# EAGLE design t84 (EAGLE 7.7.0)
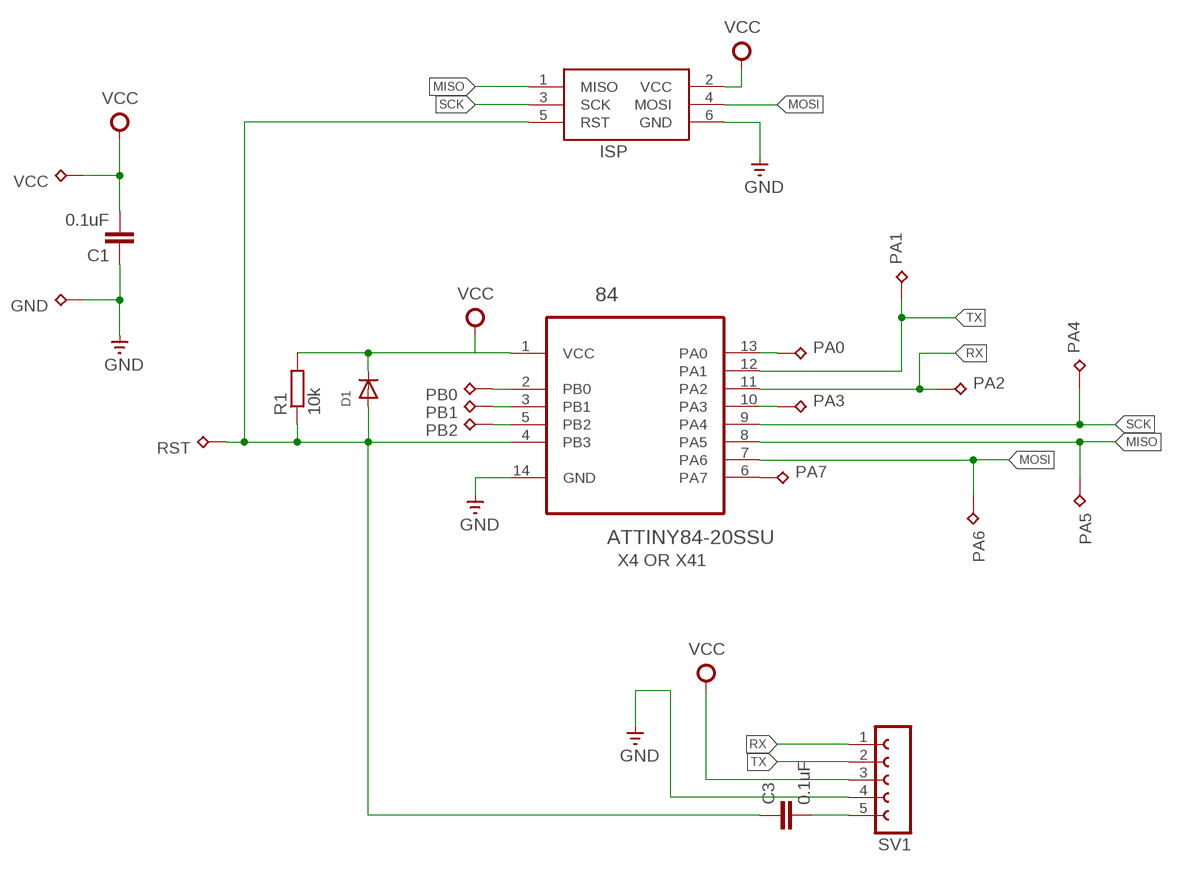
[diagram p0: schematic, sheet 1]

## Parts
84  ATTINY84-20SSU  [SOIC127P600X175-14N]
C1  0.1uF  C-EUC0805K  [C0805K]
C3  0.1uF  C-EUC0805K  [C0805K]
D1  DIODESOD-123  [SOD-123]
GND  1XPIN-HEADER  [1XPIN-HEADER]
ISP  AVRISP-6  [AVRISP]
PA0  1XPIN-HEADER  [1XPIN-HEADER]
PA1  1XPIN-HEADER  [1XPIN-HEADER]
PA2  1XPIN-HEADER  [1XPIN-HEADER]
PA3  1XPIN-HEADER  [1XPIN-HEADER]
PA4  1XPIN-HEADER  [1XPIN-HEADER]
PA5  1XPIN-HEADER  [1XPIN-HEADER]
PA6  1XPIN-HEADER  [1XPIN-HEADER]
PA7  1XPIN-HEADER  [1XPIN-HEADER]
PB0  1XPIN-HEADER  [1XPIN-HEADER]
PB1  1XPIN-HEADER  [1XPIN-HEADER]
PB2  1XPIN-HEADER  [1XPIN-HEADER]
R1  10k  R-EU_M0805  [M0805]
RST  1XPIN-HEADER  [1XPIN-HEADER]
SV1  FE05-1  [FE05-1]
VCC  1XPIN-HEADER  [1XPIN-HEADER]

## Nets
GND: 84.14(GND) C1.1 GND.P$1 ISP.6(GND) SV1.4
MISO: 84.8(PA5) ISP.1(MISO) PA5.P$1
MOSI: 84.7(PA6) ISP.4(MOSI) PA6.P$1
N$1: C3.2 SV1.5
N$11: 84.2(PB0) PB0.P$1
N$17: 84.3(PB1) PB1.P$1
N$18: 84.5(PB2) PB2.P$1
N$19: 84.6(PA7) PA7.P$1
N$20: 84.13(PA0) PA0.P$1
N$21: 84.10(PA3) PA3.P$1
RST: 84.4(PB3) C3.1 D1.A ISP.5(RST) R1.1 RST.P$1
RX: 84.11(PA2) PA2.P$1 SV1.1
SCK: 84.9(PA4) ISP.3(SCK) PA4.P$1
TX: 84.12(PA1) PA1.P$1 SV1.2
VCC: 84.1(VCC) C1.2 D1.C ISP.2(VCC) R1.2 SV1.3 VCC.P$1

## Notes on the sheet
- X4 OR X41

## Library data of the parts
84 = Atmel_By_element14_Batch_1-00:ATTINY84-20SSU: 8-bit Microcontroller with Bytes In-System Programmable Flash; MPN: ATTINY84-20SSU; OC_FARNELL: 1636955; OC_NEWARK: 03P2040; PACKAGE: SOIC-14; SUPPLIER: Atmel
C1 C3 = rcl:C-EU: CAPACITOR, European symbol
D1 = adafruit:DIODE: Diode SMADIODE - SMA Surface Mount Package 20V 1A Schottky Diode Digikey: 641-1014-6-ND DO-1N4148 - Through Hole Small Current Diode SOD-123 20V 1 A (.5mV Vf) Schottky Diode - Digikey: MBRX120TPMSCT-ND SOD-323 10V 570mA (.38mV Vf, 3ns) Schottky Diode - Digikey: ZLLS410CT-ND SOD-523 30V 30mA Schottky Diode (RB751S-40TE61) - Digikey: RB751S-40TE61CT-ND SOT23-R/W - SOT23 Package (R = Solder Paste/Reflow Ovens, W = Hand-Soldering) BAT54Film 40V 300mA - Digikey: 497-7162-1-ND
GND PA0 PA1-PA7 PB0 PB1 PB2 RST VCC = my lib:1XPIN-HEADER
ISP = adafruit:AVRISP: AVR ISP HEADER Standard 6 pin header for AVR programming
R1 = rcl:R-EU_: RESISTOR, European symbol
SV1 = con-lsta:FE05-1: FEMALE HEADER; OC_FARNELL: unknown; OC_NEWARK: unknown

## Board
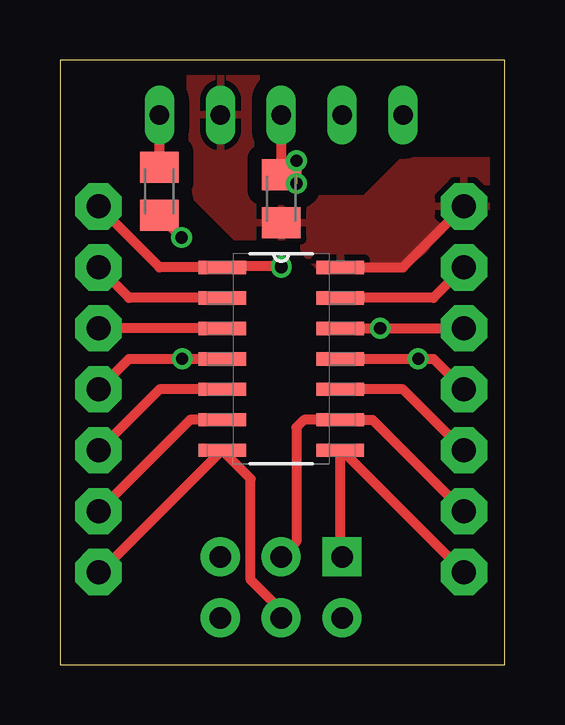
[diagram p1: board, top side]
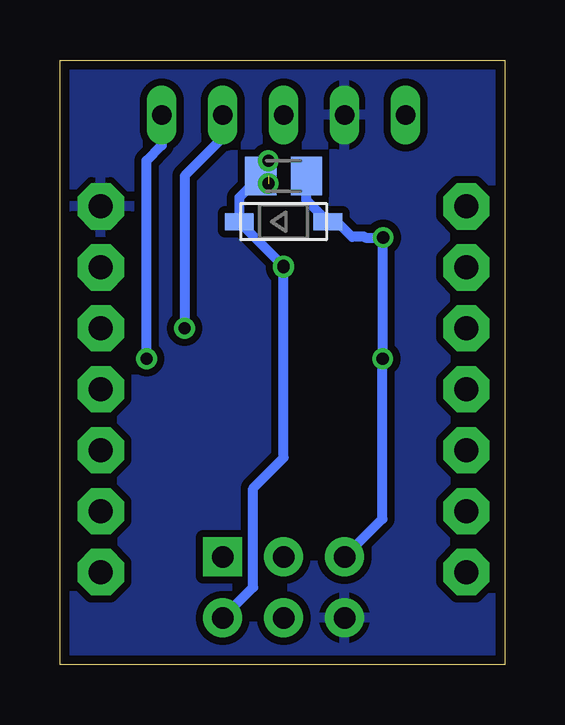
[diagram p2: board, bottom side, seen from below]

Size 18.55 x 25.19 mm. Coordinates in mm from the lower left corner, seen from the top.
Outline: 0,0 18.56,0 18.56,25.19 0,25.19 0,0
Copper layers (1*16): Top 0.0356mm / dielectric 1.5011mm / Bottom 0.0356mm
Design rules "OSHPark Rules": minimum track width 6mil, minimum drill 13mil, track to track 6mil, track to pad 6mil, pad to pad 6mil, via to via 6mil, smd to smd 6mil, copper to edge 15mil, drill to drill 6mil, minimum pad ring 7mil, minimum via ring 7mil, stop-mask expansion 3mil, vias tented up to drill 0mil, thermal gap 10mil

### Footprints (pad centres in the part's own frame; a part is rotated, then mirrored left to right if it is on the bottom)
SOIC127P600X175-14N = smd 1.981 x 0.559: 1 -2.464,3.81; 2 -2.464,2.54; 3 -2.464,1.27; 4 -2.464,0; 5 -2.464,-1.27; 6 -2.464,-2.54; 7 -2.464,-3.81; 8 2.464,-3.81; 9 2.464,-2.54; 10 2.464,-1.27; 11 2.464,0; 12 2.464,1.27; 13 2.464,2.54; 14 2.464,3.81
C0805K = smd 1.3 x 1.6: 1 -1,0; 2 1,0
SOD-123 = smd 1.2 x 0.7: A 1.85,0; C -1.85,0
1XPIN-HEADER = drill 1 pad 1.93 octagon: P$1 0,0
AVRISP = drill 0.9 pad 1.626 square: 1 -1.27,2.54 | drill 0.9 pad 1.626: 2 1.27,2.54; 3 -1.27,0; 4 1.27,0; 5 -1.27,-2.54; 6 1.27,-2.54
M0805 = smd 1.3 x 1.6: 1 -0.95,0; 2 0.95,0
FE05-1 = drill 0.813 long: 1 -5.08,0; 2 -2.54,0; 3 0,0; 4 2.54,0; 5 5.08,0

### Placement (x,y rotation side)
84  9.23,12.74 0 top
C1  9.23,19.41 90 top
C3  4.15,19.72 90 top
D1  9.23,18.46 0 bottom
GND  16.85,19.09 0 top
ISP  9.23,3.22 270 top
PA0  16.85,16.55 0 top
PA1  16.85,14.01 0 top
PA2  16.85,11.47 0 top
PA3  16.85,8.93 0 top
PA4  16.85,6.39 0 top
PA5  16.85,3.85 0 top
PA6  1.61,3.85 0 top
PA7  1.61,6.39 0 top
PB0  1.61,16.55 0 top
PB1  1.61,14.01 0 top
PB2  1.61,8.93 0 top
R1  9.23,20.36 180 bottom
RST  1.61,11.47 0 top
SV1  9.23,22.9 180 top
VCC  1.61,19.09 0 top

### Tracks (layer width: path | path; a pad name or v marks a point on that pad's centre or on a via)
GND
  Top 0.406: 84.14 14.31,16.55 GND.P$1
  pour Top (isolate 0.61): 18.43,17.82 15.89,17.82 14.31,16.55 10.81,16.55 9.54,17.82 7.32,17.82 5.42,19.73 5.42,25.12 8.27,25.12 8.27,19.41 12.72,19.41 14.31,21 18.43,21
  pour Bottom (isolate 0.305): 0.02,25.12 18.75,25.12 18.75,0.04 0.02,0.04
MISO
  Top 0.406: PA5.P$1 11.77,8.93 84.8 11.69,4.56 ISP.1
MOSI
  Top 0.406: PA6.P$1 1.68,3.85 84.7 7.96,7.74 7.96,3.53 9.23,2.26 ISP.4
N$1
  Top 0.406: C3.2 SV1.5
N$2  (via drill 0.51)
  other vias: 9.86,21
N$3  (via drill 0.51)
  other vias: 9.86,20.04
N$11
  Top 0.406: 84.2 2.88,15.28 PB0.P$1
N$17
  Top 0.406: 84.3 PB1.P$1
N$18
  Top 0.406: 84.5 4.15,11.47 PB2.P$1
N$19
  Top 0.406: 84.6 5.42,10.2 PA7.P$1
N$20
  Top 0.406: PA0.P$1 15.58,15.28 84.13
N$21
  Top 0.406: PA3.P$1 14.31,11.47 84.10
RST  (via drill 0.51)
  Top 0.406: RST.P$1 2.88,12.74 v5.1,12.74 84.4 | C3.1 v5.07,17.79
  Bottom 0.406: ISP.5 5.1,6.07 v5.1,12.74 5.1,17.77 v5.07,17.79 5.82,17.79 5.84,17.82 6.37,17.82 7,18.46 D1.A 8.28,19.36 R1.1
RX  (via drill 0.51)
  Top 0.406: 84.11 v14.94,12.74 15.58,12.74 PA2.P$1
  Bottom 0.406: v14.94,12.74 14.94,21 14.31,21.63 SV1.1
SCK
  Top 0.406: PA4.P$1 13.04,10.2 84.9 10.18,10.2 9.86,9.88 9.86,5.12 ISP.3
TX  (via drill 0.51)
  Top 0.406: 84.12 v13.35,14.01 PA1.P$1
  Bottom 0.406: SV1.2 11.77,21.95 13.35,20.36 v13.35,14.01
VCC  (via drill 0.51)  (1 unrouted)
  Top 0.406: VCC.P$1 4.15,16.55 84.1 6.82,16.61 v9.23,16.61 | SV1.3 C1.2 | C1.2 | C1.2 9.28,20.41 9.86,21 9.86,20.04
  Bottom 0.406: ISP.2 10.5,3.22 10.5,7.34 9.22,8.62 v9.22,16.55 v9.23,16.55 v9.23,16.61 D1.C 11.08,19.46 R1.2 9.86,20.36

### Text on the board
SilkScreenTOP: RST GND VCC RX TX | 84/ / 841 | tiny
SilkScreenBOTTOM: Projected in my Room / Made in the Garage